# Altium schematic sheet fpga.SchDoc
size 594 x 420 mm; Address1: Address1; Address2: Address2; Address3: Address3; Address4: Address4; DocumentNumber: АБВГ.123456.001 Э3; SheetNumber: 3; SheetTotal: 7; Scale: 1:1; DocumentType: Схема электрическая принципиальная; FirstReferrence: АБВГ.123456.001
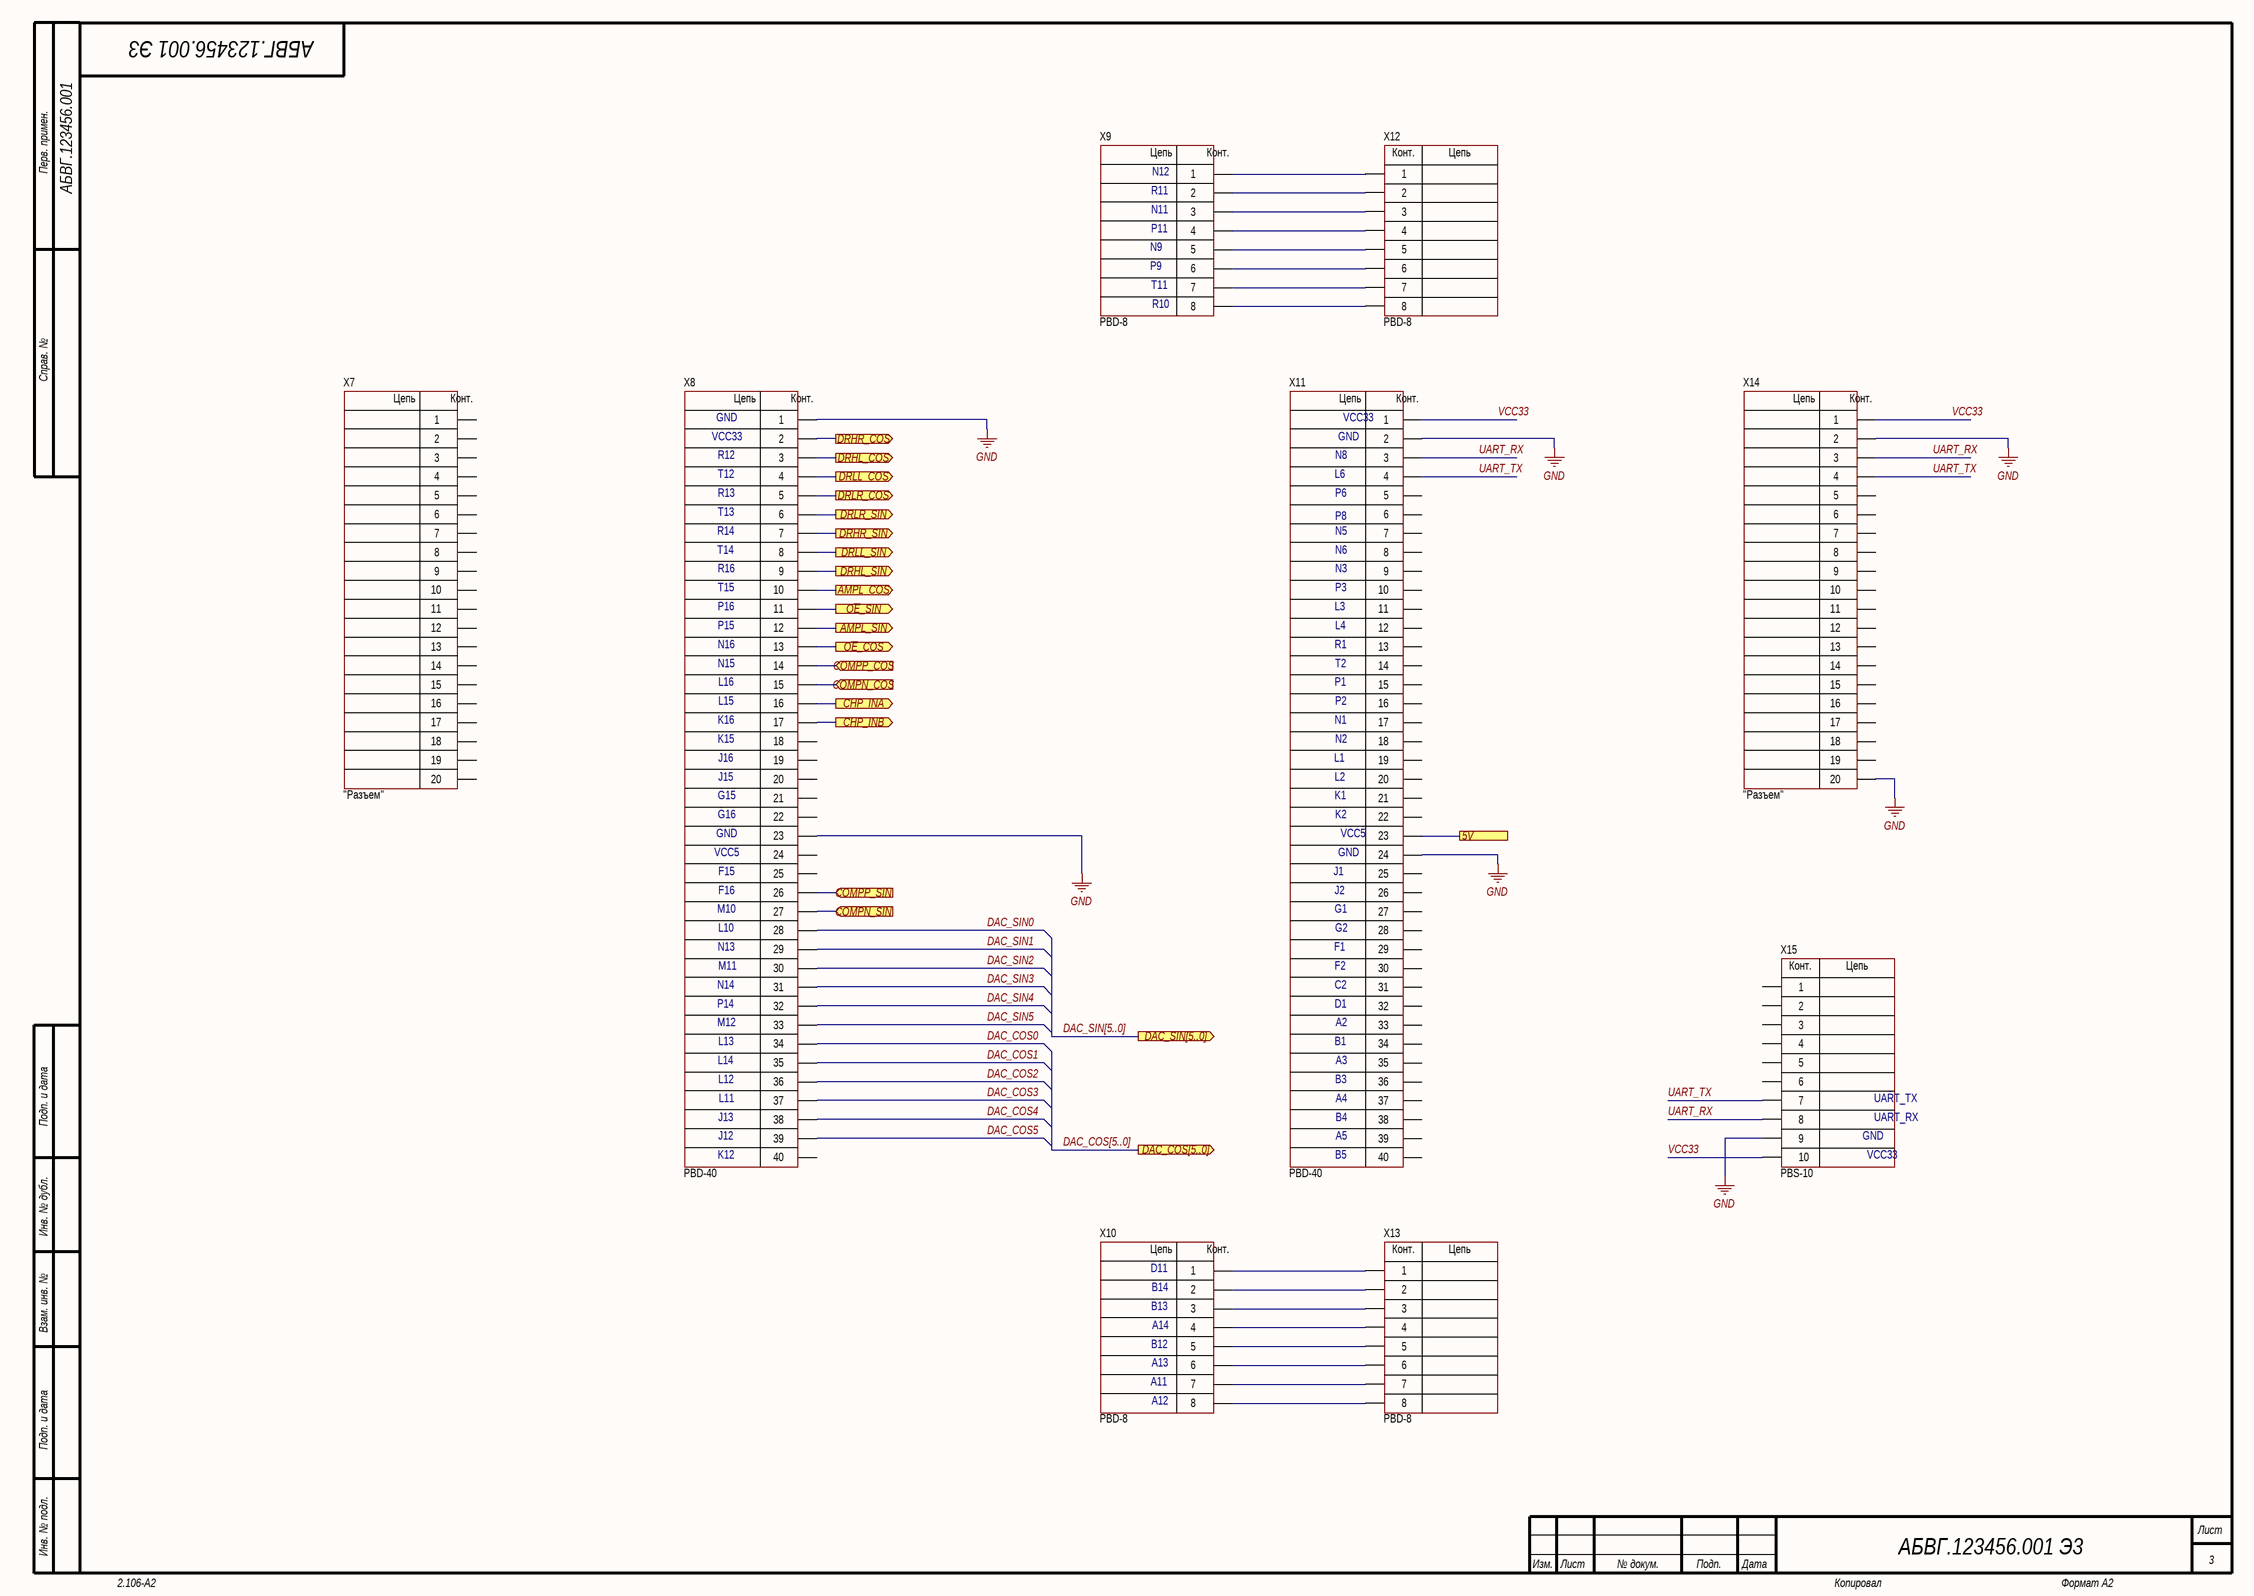
[diagram p0: fpga.SchDoc]

## Parts
X7  CommentText: "Разъем"  [CON: PBD-20]
X8  (no value)  [CON: PBD-40 (2.00)]
X9  (no value)  [CON: PBD2-8 (2.00)]
X10  (no value)  [CON: PBD2-8 (2.00)]
X11  (no value)  [CON: PBD-40 (2.00)]
X12  (no value)  [CON: PBD-8]
X13  (no value)  [CON: PBD-8]
X14  CommentText: "Разъем"  [CON: PBD-20]
X15  PartNumber: PBS-10  [CON: PBS-10R]

## Ports
5V, AMPL_COS (out), AMPL_SIN (out), CHP_INA (out), CHP_INB (out), COMPN_COS (in), COMPN_SIN (in), COMPP_COS (in), COMPP_SIN (in), DAC_COS[5..0] (out), DAC_SIN[5..0] (out), DRHL_COS (out), DRHL_SIN (out), DRHR_COS (out), DRHR_SIN (out), DRLL_COS (out), DRLL_SIN (out), DRLR_COS (out), DRLR_SIN (out), O~{E}_COS (out), O~{E}_SIN (out)

## Nets
GND: X8.1 X8.23 X11.2 X11.24 X14.2 X14.20 X15.9
5V: X11.23 ; port 5V
AMPL_COS: X8.10 ; port AMPL_COS
AMPL_SIN: X8.12 ; port AMPL_SIN
CHP_INA: X8.16 ; port CHP_INA
CHP_INB: X8.17 ; port CHP_INB
COMPN_COS: X8.15 ; port COMPN_COS
COMPN_SIN: X8.27 ; port COMPN_SIN
COMPP_COS: X8.14 ; port COMPP_COS
COMPP_SIN: X8.26 ; port COMPP_SIN
DAC_COS0: X8.34
DAC_COS1: X8.35
DAC_COS2: X8.36
DAC_COS3: X8.37
DAC_COS4: X8.38
DAC_COS5: X8.39
DAC_SIN0: X8.28
DAC_SIN1: X8.29
DAC_SIN2: X8.30
DAC_SIN3: X8.31
DAC_SIN4: X8.32
DAC_SIN5: X8.33
DRHL_COS: X8.3 ; port DRHL_COS
DRHL_SIN: X8.9 ; port DRHL_SIN
DRHR_COS: X8.2 ; port DRHR_COS
DRHR_SIN: X8.7 ; port DRHR_SIN
DRLL_COS: X8.4 ; port DRLL_COS
DRLL_SIN: X8.8 ; port DRLL_SIN
DRLR_COS: X8.5 ; port DRLR_COS
DRLR_SIN: X8.6 ; port DRLR_SIN
O~{E}_COS: X8.13 ; port O~{E}_COS
O~{E}_SIN: X8.11 ; port O~{E}_SIN
UART_RX: X11.3 X14.3 X15.8
UART_TX: X11.4 X14.4 X15.7
VCC33: X11.1 X14.1 X15.10
NetX9_1: X9.1 X12.1
NetX9_2: X9.2 X12.2
NetX9_3: X9.3 X12.3
NetX9_4: X9.4 X12.4
NetX9_5: X9.5 X12.5
NetX9_6: X9.6 X12.6
NetX9_7: X9.7 X12.7
NetX9_8: X9.8 X12.8
NetX10_1: X10.1 X13.1
NetX10_2: X10.2 X13.2
NetX10_3: X10.3 X13.3
NetX10_4: X10.4 X13.4
NetX10_5: X10.5 X13.5
NetX10_6: X10.6 X13.6
NetX10_7: X10.7 X13.7
NetX10_8: X10.8 X13.8

Not connected (* = marked no-connect by the designer): X7 1 2 3 4 5 6 7 8 9 10 11 12 13 14 15 16 17 18 19 20; X8 18 19 20 21 22 24 25 40; X11 5 6 7 8 9 10 11 12 13 14 15 16 17 18 19 20 21 22 25 26 27 28 29 30 31 32 33 34 35 36 37 38 39 40; X14 5 6 7 8 9 10 11 12 13 14 15 16 17 18 19; X15 1 2 3 4 5 6

## Buses and harness runs
bus DAC_COS[5..0] = port DAC_COS[5..0]
bus DAC_SIN[5..0] = port DAC_SIN[5..0]

## Notes on the sheet
- R11
- N11
- N12
- N9
- P11
- P9
- T11
- R10
- VCC33
- GND
- R12
- N8
- T12
- R13
- L6
- P6
- T14
- R14
- T13
- P8
- N5
- N6
- R16
- T15
- N3
- P3
- P16
- N16
- P15
- R1
- L3
- L4
- N15
- L16
- P1
- T2
- K16
- K15
- L15
- N1
- P2
- N2
- J16
- J15
- L1
- L2
- G15
- G16
- K1
- K2
- VCC5
- F15
- J1
- M10
- F16
- L10
- J2
- G1
- G2
- N13
- M11
- F1
- F2
- N14
- M12
- P14
- D1
- C2
- A2
- L14
- L13
- L12
- B1
- B3
- A3
- J13
- L11
- B4
- A4
- UART_RX
- UART_TX
- K12
- J12
- B5
- A5
- D11
- B13
- B14
- B12
- A13
- A14
- A11
- A12
- Перв. примен.
- Справ. №
- Подп. и дата
- Инв. № дубл.
- Взам. инв. №
- Инв. № подл.
- Изм.
- Лист
- № докум.
- Подп.
- Дата
- 2.106-A2
- Копировал
- Формат А2
- (in symbol PBD-8) Цепь; Конт.
- (in symbol PBD-20) Цепь; Конт.
- (in symbol PBD-40) Цепь; Конт.
- (in symbol PBS-10R) Конт.; Цепь

## Library data of the parts
X7 X14 = PBD-20: Manufacturer: Connfly; ValueManufacturerPartNumber: Connector, 20pin, 2.54mm, 500VAC, 3A; TypeConnector: Connector; VoltageMax: 500VAC; Pitch: 2.54mm; CurrentMax: 3A; Multichannel: 20pin; HelpURL: https://www.chipdip.ru/product/pbd-20; PartNumber: PBD-20
X8 X11 = PBD-40: Manufacturer: Connfly; ValueManufacturerPartNumber: Connector, 20pin, 2.54mm, 500VAC, 3A; TypeConnector: Connector; VoltageMax: 500VAC; Pitch: 2.54mm; CurrentMax: 3A; Multichannel: 20pin; CommentText: "Разъем"; HelpURL: https://www.chipdip.ru/product/pls-20; PartNumber: PBD-40
X9 X10 X12 X13 = PBD-8: Manufacturer: Connfly; ValueManufacturerPartNumber: Connector, 8pin, 2.54mm, 500VAC, 3A; TypeConnector: Connector; VoltageMax: 500VAC; Pitch: 2.54mm; CurrentMax: 3A; Multichannel: 8pin; CommentText: "Разъем"; HelpURL: https://www.chipdip.ru/product/pbd-8; PartNumber: PBD-8
X15 = PBS-10R: Manufacturer: Connfly; ValueManufacturerPartNumber: Connector, 10pin, 2.54mm, 500VAC, 3A; TypeConnector: Connector; VoltageMax: 500VAC; Pitch: 2.54mm; CurrentMax: 3A; Multichannel: 10pin; CommentText: "Разъем"; HelpURL: https://www.chipdip.ru/product/pbs-10